# Altium schematic sheet POWER_BANK_PART.SchDoc
size A4; SheetNumber: 2; SheetTotal: 2
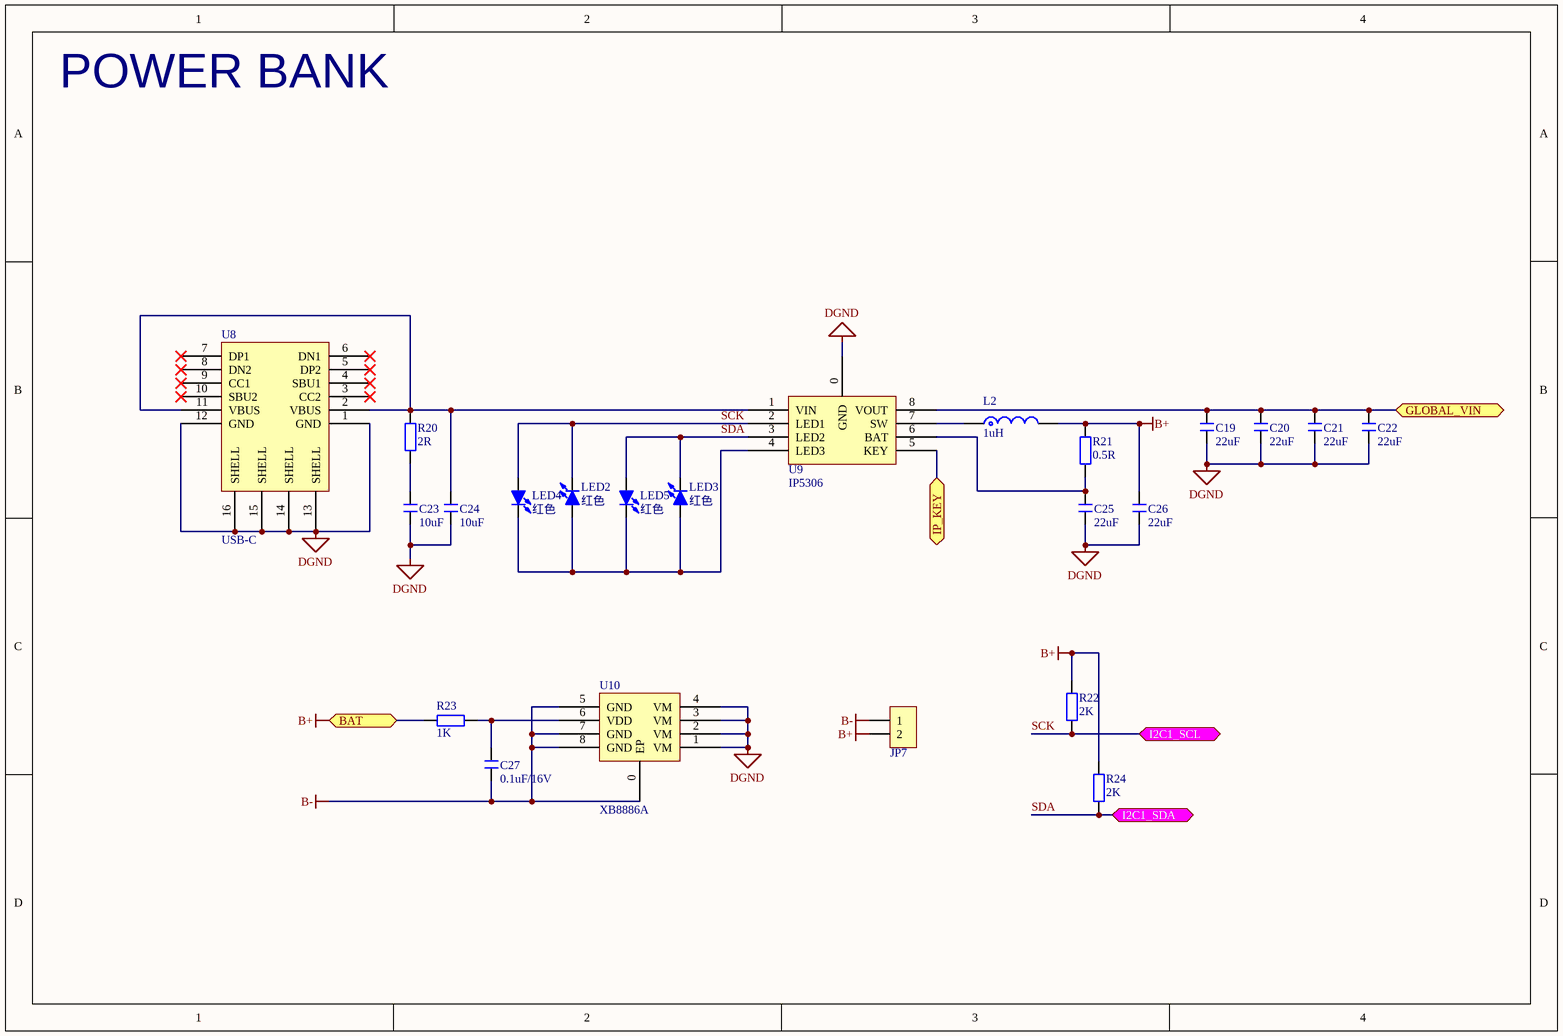
[diagram p0: POWER_BANK_PART.SchDoc]

## Parts
C19  22uF  [C 0603_L]
C20  22uF  [C 0603_L]
C21  22uF  [C 0603_L]
C22  22uF  [C 0603_L]
C23  10uF  [C 0603_L]
C24  10uF  [C 0603_L]
C25  22uF  [C 0603_L]
C26  22uF  [C 0603_L]
C27  0.1uF/16V  [C 0603_L]
JP7  HDR-1X2  [KF301-5.0-2P]  (value not drawn)
L2  1uH  [CD43]
LED2  红色  [LED 0603W]
LED3  红色  [LED 0603W]
LED4  红色  [LED 0603W]
LED5  红色  [LED 0603W]
R20  2R  [R 0603_L]
R21  0.5R  [R 0603_L]
R22  2K  [R 0603_L]
R23  1K  [R 0603_L]
R24  2K  [R 0603_L]
U8  USB-C  [USB-C-16]
U9  IP5306  [SOP-8-G]
U10  XB8886A  [SOP-8-G]

## Ports
BAT (bidir), GLOBAL_VIN (bidir), I2C1_SCL (bidir), I2C1_SDA (bidir), IP_KEY (bidir)

## Nets
B+: C26.1 JP7.2 L2.2 R21.2 R22.2 R23.1 R24.2 ; port BAT
B-: C27.2 JP7.1 U10.0(EP) U10.5(GND) U10.7(GND) U10.8(GND)
DGND: C19.2 C20.2 C21.2 C22.2 C23.2 C24.2 C25.2 C26.2 U8.1(GND) U8.12(GND) U8.13(SHELL) U8.14(SHELL) U8.15(SHELL) U8.16(SHELL) U9.0(GND) U10.1(VM) U10.2(VM) U10.3(VM) U10.4(VM)
GLOBAL_VIN: C19.1 C20.1 C21.1 C22.1 U9.8(VOUT) ; port GLOBAL_VIN
IP_KEY: U9.5(KEY) ; port IP_KEY
SCK: LED2.2(K) LED4.1(A) R22.1 U9.2(LED1) ; port I2C1_SCL
SDA: LED3.2(K) LED5.1(A) R24.1 U9.3(LED2) ; port I2C1_SDA
NetC23_1: C23.1 R20.1
NetC24_1: C24.1 R20.2 U8.2(VBUS) U8.11(VBUS) U9.1(VIN)
NetC25_1: C25.1 R21.1 U9.6(BAT)
NetC27_1: C27.1 R23.2 U10.6(VDD)
NetL2_1: L2.1 U9.7(SW)
NetLED2_1: LED2.1(A) LED3.1(A) LED4.2(K) LED5.2(K) U9.4(LED3)

Not connected (* = marked no-connect by the designer): U8 3(CC2)* 4(SBU1)* 5(DP2)* 6(DN1)* 7(DP1)* 8(DN2)* 9(CC1)* 10(SBU2)*

## Notes on the sheet
- POWER BANK

## Library data of the parts
C19-C27 = C: 无极性贴片电容; 版权归属: 源创客; BOM名称: 无极性贴片电容; 学习资源: www.ooocke.com
JP7 = Header 2: 2P接插件; 版权归属: 源创客; BOM名称: 2P接插件; 学习资源: www.ooocke.com
L2 = L-CD: 贴片功率电感; BOM名称: 功率电感; 版权归属: 源创客; 学习资源: www.ooocke.com
LED2-LED5 = LED-SMD: 贴片LED; 版权归属: 源创客; BOM名称: 贴片LED; 学习资源: www.ooocke.com
R20-R24 = R: 贴片电阻; 版权归属: 源创客; BOM名称: 贴片电阻; 学习资源: www.ooocke.com
U8 = USB-C-16P: USB-C型母接口; 版权归属: 源创客; BOM名称: USB-C型母接口; 学习资源: www.ooocke.com
U9 = IP5306: 电源芯片
U10 = XB8886A: 锂电池保护芯片